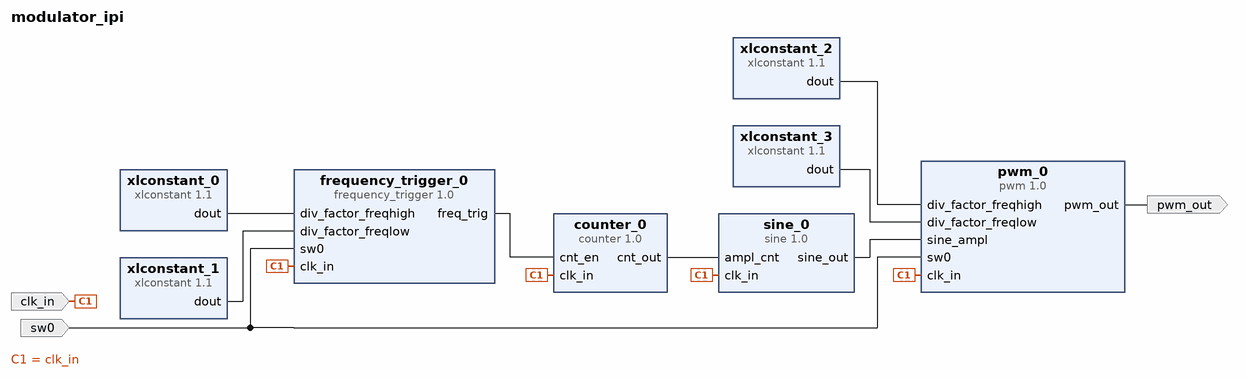
[diagram p0: block diagram of the top level]
# Vivado block design modulator_ipi, xc7a35tcpg236-1, Vivado 2019.2
create_bd_design modulator_ipi

create_bd_port -dir I clk_in
create_bd_port -dir I sw0
create_bd_port -dir O pwm_out

create_bd_cell -type ip -vlnv MEE_EC:user:frequency_trigger:1.0 frequency_trigger_0
create_bd_cell -type ip -vlnv MEE_EC:user:pwm:1.0 pwm_0
create_bd_cell -type ip -vlnv MEE_EC:user:counter:1.0 counter_0
set_property -dict {CONFIG.cnt_value_p {"0011111111"} CONFIG.depth_p {"0000001000"}} [get_bd_cells counter_0]
create_bd_cell -type ip -vlnv MEE_EC:user:sine:1.0 sine_0
set_property -dict {CONFIG.depth_p {"0000001000"} CONFIG.width_p {"0000001100"}} [get_bd_cells sine_0]
create_bd_cell -type ip -vlnv xilinx.com:ip:xlconstant:1.1 xlconstant_0
set_property -dict {CONFIG.CONST_VAL 110592 CONFIG.CONST_WIDTH 32} [get_bd_cells xlconstant_0]
create_bd_cell -type ip -vlnv xilinx.com:ip:xlconstant:1.1 xlconstant_1
set_property -dict {CONFIG.CONST_VAL 389120 CONFIG.CONST_WIDTH 32} [get_bd_cells xlconstant_1]
create_bd_cell -type ip -vlnv xilinx.com:ip:xlconstant:1.1 xlconstant_2
set_property -dict {CONFIG.CONST_VAL 27 CONFIG.CONST_WIDTH 32} [get_bd_cells xlconstant_2]
create_bd_cell -type ip -vlnv xilinx.com:ip:xlconstant:1.1 xlconstant_3
set_property -dict {CONFIG.CONST_VAL 95 CONFIG.CONST_WIDTH 32} [get_bd_cells xlconstant_3]

# ---- connections ----

connect_bd_net [get_bd_pins xlconstant_0/dout] [get_bd_pins frequency_trigger_0/div_factor_freqhigh]
connect_bd_net [get_bd_pins xlconstant_1/dout] [get_bd_pins frequency_trigger_0/div_factor_freqlow]
connect_bd_net [get_bd_pins xlconstant_2/dout] [get_bd_pins pwm_0/div_factor_freqhigh]
connect_bd_net [get_bd_pins xlconstant_3/dout] [get_bd_pins pwm_0/div_factor_freqlow]
connect_bd_net [get_bd_ports clk_in] \
  [get_bd_pins frequency_trigger_0/clk_in] [get_bd_pins pwm_0/clk_in] [get_bd_pins counter_0/clk_in] \
  [get_bd_pins sine_0/clk_in]
connect_bd_net -net sw0_1 [get_bd_ports sw0] [get_bd_pins frequency_trigger_0/sw0] [get_bd_pins pwm_0/sw0]
connect_bd_net [get_bd_pins pwm_0/pwm_out] [get_bd_ports pwm_out]
connect_bd_net [get_bd_pins frequency_trigger_0/freq_trig] [get_bd_pins counter_0/cnt_en]
connect_bd_net [get_bd_pins counter_0/cnt_out] [get_bd_pins sine_0/ampl_cnt]
connect_bd_net [get_bd_pins sine_0/sine_out] [get_bd_pins pwm_0/sine_ampl]

validate_bd_design
save_bd_design
